# EAGLE design pmm (EAGLE 9.6.1)
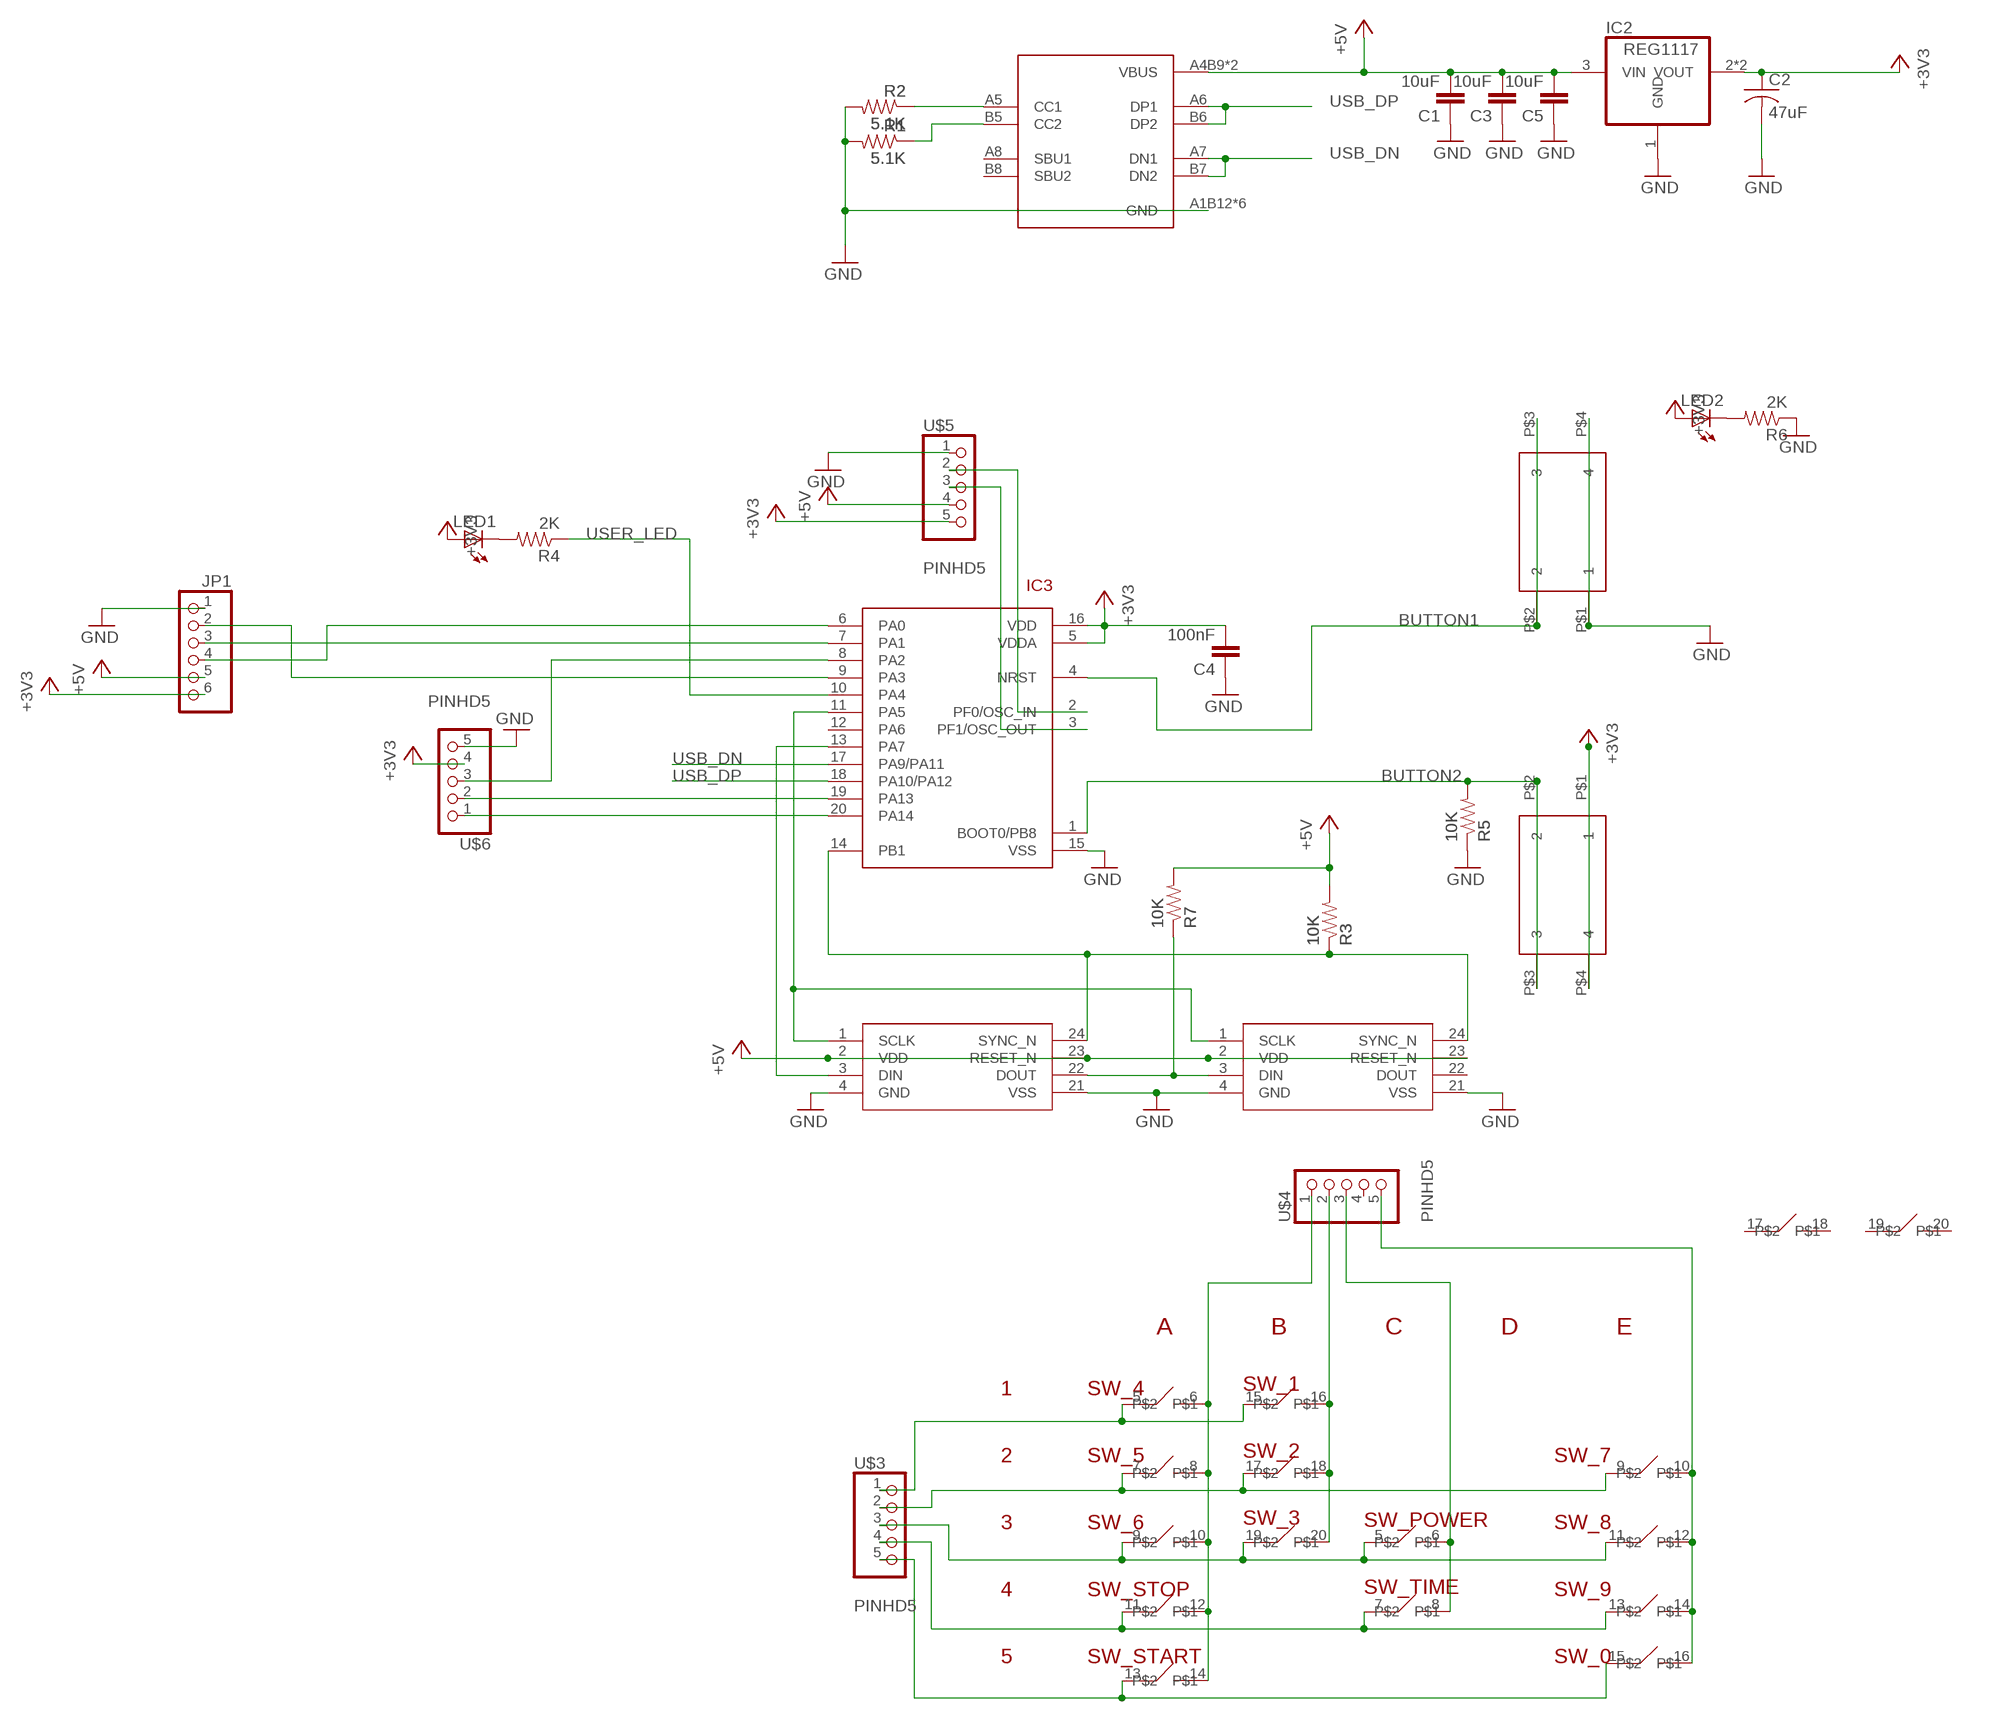
[diagram p0: schematic, sheet 1]

## Parts
C1  10uF  CAP0805  [0805@1]
C2  47uF  C-USC1210  [C1210]
C3  10uF  CAP0805  [0805@1]
C4  100nF  CAP0805  [0805@1]
C5  10uF  CAP0805  [0805@1]
IC2  REG1117  [SOT223]
IC3  STM32F042F4  [TSSOP20]
JP1  PINHD-1X6CB  [1X06-CLEANBIG]
LED1  LEDCHIP-LED0805  [CHIP-LED0805]
LED2  LEDCHIP-LED0805  [CHIP-LED0805]
R1  5.1K  RESISTOR0805-RES  [0805]
R2  5.1K  RESISTOR0805-RES  [0805]
R3  10K  RESISTOR0805-RES  [0805]
R4  2K  RESISTOR0805-RES  [0805]
R5  10K  RESISTOR0805-RES  [0805]
R6  2K  RESISTOR0805-RES  [0805]
R7  10K  RESISTOR0805-RES  [0805]
SW3  324_SW  [342_SWICH_FOOT]
SW4  324_SW  [342_SWICH_FOOT]
U2  USBC_16P  [USBC_16P_FOOT]
U$1  ADG714_SEPERATE  [TSSOP-24]
U$2  ADG714_SEPERATE  [TSSOP-24]
U$3  PINHD5  [1X05]
U$4  PINHD5  [1X05]
U$5  PINHD5  [1X05]
U$6  PINHD5  [1X05]

## Nets
1: U$1.5 U$1.15 U$3.1
2: U$1.7 U$1.17 U$2.9 U$3.2
3: U$1.9 U$1.19 U$2.5 U$2.11 U$3.3
4: U$1.11 U$2.7 U$2.13 U$3.4
5: U$1.13 U$2.15 U$3.5
+3V3: C2.1 C4.2 IC2.2(VOUT) IC2.4(VOUT) IC3.5(VDDA) IC3.16(VDD) JP1.6 LED1.A LED2.A SW4.P$1 SW4.P$4 U$5.5 U$6.4
+5V: C1.2 C3.2 C5.2 IC2.3(VIN) JP1.5 R3.2 R7.2 U2.A4B9(VBUS) U2.B4A9(VBUS) U$1.2(VDD) U$1.23(RESET_N) U$2.2(VDD) U$2.23(RESET_N) U$5.4
A: U$1.6 U$1.8 U$1.10 U$1.12 U$1.14 U$4.1
B: U$1.16 U$1.18 U$1.20 U$4.2
BUTTON1: IC3.4(NRST) SW3.P$2 SW3.P$3
BUTTON2: IC3.1(BOOT0/PB8) R5.2 SW4.P$2 SW4.P$3
C: U$2.6 U$2.8 U$4.3
E: U$2.10 U$2.12 U$2.14 U$2.16 U$4.5
GND: C1.1 C2.2 C3.1 C4.1 C5.1 IC2.1(GND) IC3.15(VSS) JP1.1 R1.2 R2.2 R5.1 R6.1 SW3.P$1 SW3.P$4 U2.A1B12(GND) U2.B11A12(GND) U2.P$13(GND) U2.P$14(GND) U2.P$15(GND) U2.P$16(GND) U$1.4(GND) U$1.21(VSS) U$2.4(GND) U$2.21(VSS) U$5.1 U$6.5
N$1: IC3.11(PA5) U$1.1(SCLK) U$2.1(SCLK)
N$2: IC3.13(PA7) U$1.3(DIN)
N$3: R7.1 U$1.22(DOUT) U$2.3(DIN)
N$4: IC3.14(PB1) R3.1 U$1.24(SYNC_N) U$2.24(SYNC_N)
N$5: LED1.C R4.2
N$6: IC3.8(PA2) U$6.3
N$7: IC3.20(PA14) U$6.1
N$8: IC3.19(PA13) U$6.2
N$9: IC3.9(PA3) JP1.2
N$10: IC3.7(PA1) JP1.3
N$11: IC3.6(PA0) JP1.4
N$12: IC3.2(PF0/OSC_IN) U$5.2
N$13: IC3.3(PF1/OSC_OUT) U$5.3
N$29: LED2.C R6.2
N$31: R1.1 U2.B5(CC2)
N$33: R2.1 U2.A5(CC1)
USB_DN: IC3.17(PA9/PA11) U2.A7(DN1) U2.B7(DN2)
USB_DP: IC3.18(PA10/PA12) U2.A6(DP1) U2.B6(DP2)
USER_LED: IC3.10(PA4) R4.1
Unconnected: IC3.12(PA6) U2.A8(SBU1) U2.B8(SBU2) U$2.17 U$2.18 U$2.19 U$2.20 U$2.22(DOUT) U$4.4

## Notes on the sheet
- A              B              C              D              E
- SW_1
  
  
  SW_2
  
  
  SW_3
- SW_POWER
  
  
  SW_TIME
- 1
  
  
  2
  
  
  3
  
  
  4
  
  
  5
- SW_4
  
  
  SW_5
  
  
  SW_6
  
  
  SW_STOP
  
  
  SW_START
- SW_7
  
  
  SW_8
  
  
  SW_9
  
  
  SW_0

## Library data of the parts
C1 C3-C5 = clock:CAP: Capacitor Standard 0603 ceramic capacitor, and 0.1" leaded capacitor.
C2 = clock:C-US: CAPACITOR, American symbol
IC2 = clock:REG1117: 800mA and 1A Low Dropout (LDO) Positive Regulator 1.8V, 2.5V, 2.85V, 3.3V, 5V, and Adj; MPN: REG1117; OC_FARNELL: 1097566; OC_NEWARK: 14P6981
IC3 = tx:STM32F042F4
JP1 = adafruit:PINHD-1X6: PIN HEADER
LED1 LED2 = adafruit:LED: LED OSRAM: - CHIPLED LG R971, LG N971, LY N971, LG Q971, LY Q971, LO R971, LY R971 LH N974, LH R974 LS Q976, LO Q976, LY Q976 LO Q996 - Hyper CHIPLED LW Q18S LB Q993, LB Q99A, LB R99A - SideLED LS A670, LO A670, LY A670, LG A670, LP A670 LB A673, LV A673, LT A673, LW A673 LH A674 LY A675 LS A676, LA A676, LO A676, LY A676, LW A676 LS A679, LY A679, LG A679 - Hyper Micro SIDELED® LS Y876, LA Y876, LO Y876, LY Y876 LT Y87S - SmartLED LW L88C, LW L88S LB L89C, LB L89S, LG L890 LS L89K, LO L89K, LY L89K LS L896, LA L896, LO L896, LY L896 - TOPLED LS T670, LO T670, LY T670, LG T670, LP T670 LSG T670, LSP T670, LSY T670, LOP T670, LYG T670 LG T671, LOG T671, LSG T671 LB T673, LV T673, LT T673, LW T673 LH T674 LS T676, LA T676, LO T676, LY T676, LB T676, LH T676, LSB T676, LW T676 LB T67C, LV T67C, LT T67C, LS T67K, LO T67K, LY T67K, LW E67C LS E67B, LA E67B, LO E67B, LY E67B, LB E67C, LV E67C, LT E67C LW T67C LS T679, LY T679, LG T679 LS T770, LO T770, LY T770, LG T770, LP T770 LB T773, LV T773, LT T773, LW T773 LH T774 LS E675, LA E675, LY E675, LS T675 LS T776, LA T776, LO T776, LY T776, LB T776 LHGB T686 LT T68C, LB T68C - Hyper Mini TOPLED® LB M676 - Mini TOPLED Santana® LG M470 LS M47K, LO M47K, LY M47K Source: http://www.osram.convergy.de/
R1-R3 R5 R7 = joyAnalog:RESISTOR: Resistor Basic schematic elements and footprints for 0603, 1206, and PTH resistors.
R4 R6 = SparkFun-Passives:RESISTOR: Resistor Basic schematic elements and footprints for 0603, 1206, and PTH resistors.
SW3 SW4 = 3pos_slide_switch_centered:324_SW
U2 = my_usbc_16p:USBC_16P
U$1 U$2 = pmm:ADG714_SEPERATE
U$3-U$6 = adafruit_changed:PINHD5

## Board
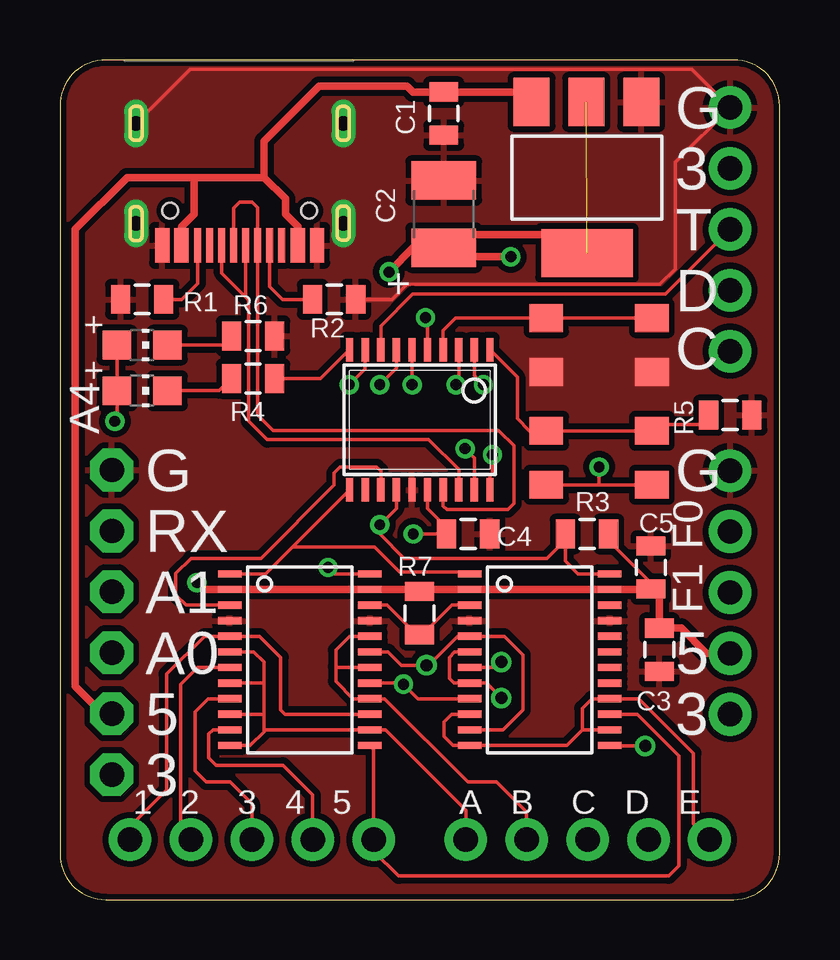
[diagram p1: board, top side]
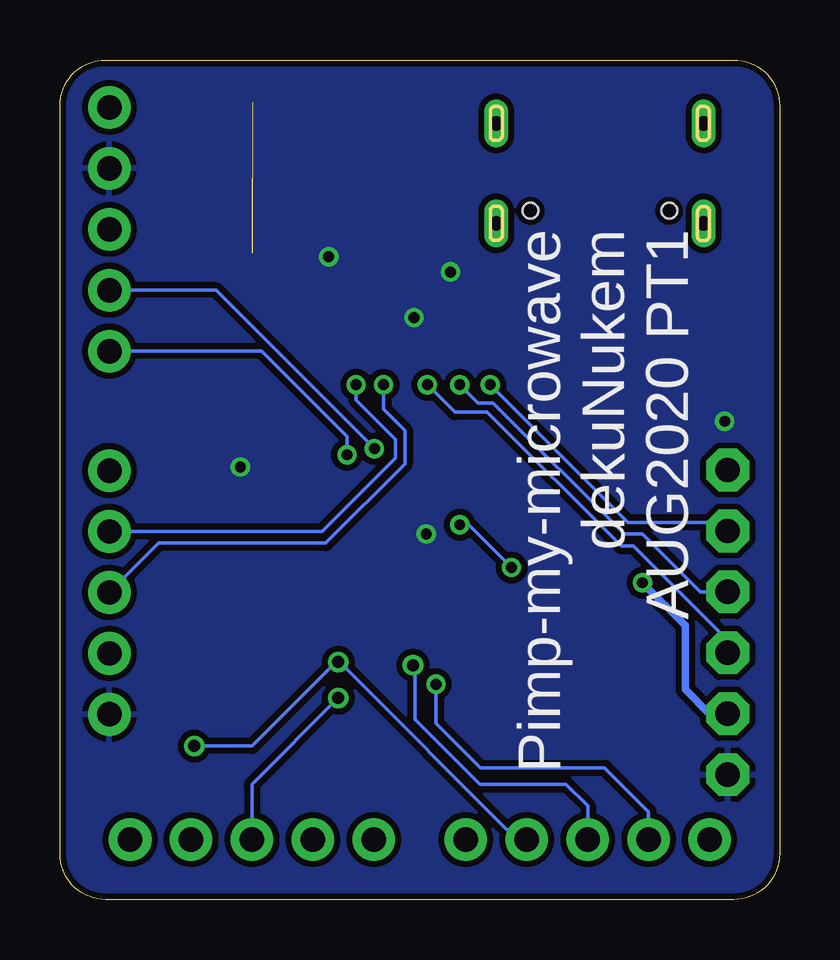
[diagram p2: board, bottom side, seen from below]

Size 30 x 35 mm. Coordinates in mm from the lower left corner, seen from the top.
Outline: 0,33.09 0,1.91 arc90 1.91,0 28.09,0 arc90 30,1.91 30,33.09 arc90 28.09,35 1.91,35 arc90 0,33.09
Copper layers (1*16): Top 0.035mm / dielectric 1.5mm / Bottom 0.035mm
Design rules "deku_2layer_6mil": minimum track width 6mil, minimum drill 15mil, track to track 6mil, track to pad 6mil, pad to pad 6mil, via to via 6mil, smd to smd 6mil, copper to edge 10mil, drill to drill 6mil, minimum pad ring 7mil, minimum via ring 7mil, stop-mask expansion 4mil, vias tented up to drill 25mil, thermal gap 10mil

### Footprints (pad centres in the part's own frame; a part is rotated, then mirrored left to right if it is on the bottom)
0805@1 = smd 0.8 x 1.2: 1 -0.9,0; 2 0.9,0
C1210 = smd 1.6 x 2.7: 1 -1.4,0; 2 1.4,0
SOT223 = smd 1.499 x 2.007: 1 -2.261,-3.15; 2 0.025,-3.15; 3 2.311,-3.15 | smd 3.81 x 2.007: 4 0,3.15
TSSOP20 = smd 0.305 x 0.991: 1 -2.925,-2.918; 2 -2.275,-2.918; 3 -1.625,-2.918; 4 -0.975,-2.918; 5 -0.325,-2.918; 6 0.325,-2.918; 7 0.975,-2.918; 8 1.625,-2.918; 9 2.275,-2.918; 10 2.925,-2.918; 11 2.925,2.918; 12 2.275,2.918; 13 1.625,2.918; 14 0.975,2.918; 15 0.325,2.918; 16 -0.325,2.918; 17 -0.975,2.918; 18 -1.625,2.918; 19 -2.275,2.918; 20 -2.925,2.918
1X06-CLEANBIG = drill 1.016 pad 1.778 octagon: 1 -6.35,0; 2 -3.81,0; 3 -1.27,0; 4 1.27,0; 5 3.81,0; 6 6.35,0
CHIP-LED0805 = smd 1.2 x 1.2: A 0,-1.05; C 0,1.05
0805 = smd 0.8 x 1.2: 1 -0.9,0; 2 0.9,0
342_SWICH_FOOT = smd 1.4 x 1.15: P$1 -2.2,-1.125; P$2 -2.2,1.125; P$3 2.2,1.125; P$4 2.2,-1.125
USBC_16P_FOOT = smd 0.6 x 1.45: A1B12 -3.225,3.848; A4B9 -2.425,3.848; B4A9 2.425,3.848; B11A12 3.225,3.848 | smd 0.3 x 1.45: A5 -1.25,3.848; A6 -0.25,3.848; A7 0.25,3.848; A8 1.25,3.848; B5 1.75,3.848; B6 0.75,3.848; B7 -0.75,3.848; B8 -1.75,3.848 | drill 0.6 pad 1 long: P$13 -4.32,2.933; P$14 4.32,2.933; P$15 -4.32,-1.248; P$16 4.32,-1.248 | hole 0.65: -2.89,2.402; 2.89,2.402
TSSOP-24 = smd 0.305 x 0.991: 1 -3.575,-2.918; 2 -2.925,-2.918; 3 -2.275,-2.918; 4 -1.625,-2.918; 5 -0.975,-2.918; 6 -0.325,-2.918; 7 0.325,-2.918; 8 0.975,-2.918; 9 1.625,-2.918; 10 2.275,-2.918; 11 2.925,-2.918; 12 3.575,-2.918; 13 3.575,2.918; 14 2.925,2.918; 15 2.275,2.918; 16 1.625,2.918; 17 0.975,2.918; 18 0.325,2.918; 19 -0.325,2.918; 20 -0.975,2.918; 21 -1.625,2.918; 22 -2.275,2.918; 23 -2.925,2.918; 24 -3.575,2.918
1X05 = drill 1.016 pad 1.778: 1 -6.35,0; 2 -3.81,0; 3 -1.27,0; 4 1.27,0; 5 3.81,0

### Placement (x,y rotation side)
C1  16,32.77 90 top
C2  16,28.57 90 top
C3  24.99,10.41 90 top
C4  17.02,15.24 180 top
C5  24.64,13.84 270 top
IC2  21.97,30.1 180 top
IC3  15,20 180 top
JP1  2.16,11.56 270 top
LED1  3.43,21.21 270 top
LED2  3.43,23.11 270 top
R1  3.43,25.02 180 top
R2  11.43,25.02 0 top
R3  21.97,15.24 0 top
R4  8.05,21.72 180 top
R5  27.94,20.19 180 top
R6  8.05,23.5 180 top
R7  14.99,11.94 90 top
SW3  22.48,23.11 0 top
SW4  22.48,18.41 0 top
U2  7.49,31.11 180 top
U$1  10,10 270 top
U$2  20,10 270 top
U$3  9.27,2.5 0 top
U$4  23.27,2.5 0 top
U$5  27.94,11.53 270 top
U$6  27.94,29.21 90 top

### Tracks (layer width: path | path; a pad name or v marks a point on that pad's centre or on a via)
1
  Top 0.152: U$1.15 9.38,7.72 9.2,7.9 9.2,10.1 8.32,10.97 U$1.5 6.02,10.97 4.45,9.4 4.45,4.57 2.92,3.05 U$3.1
2  (via drill 0.45)
  Top 0.152: U$1.17 14.28,9.03 v14.32,8.97 14.93,8.38 U$2.9 | U$1.7 5.74,9.68 5.03,8.97 5.03,2.93 U$3.2
  Bottom 0.152: v14.32,8.97 14.32,7.35 12.48,5.5 7.3,5.5 5.46,3.66 U$3.2
3  (via drill 0.5)
  Top 0.152: U$1.9 6.17,8.38 5.63,7.83 5.63,5.37 6.1,4.9 7.1,4.9 8,4 U$3.3 | U$2.11 18.48,7.08 19.3,7.9 19.3,10.2 18.52,10.97 U$2.5 16.56,10.97 15.36,9.77 v15.28,9.77 14.23,9.77 13.68,10.32 U$1.19
  Bottom 0.152: v15.28,9.77 15.2,9.69 15.2,7.5 12.49,4.8 8.9,4.8 8,3.9 U$3.3
4  (via drill 0.5)
  Top 0.152: U$1.11 6.38,7.08 6.2,6.9 6.2,5.9 6.5,5.6 9.3,5.6 10.54,4.36 U$3.4 | U$2.7 18.18,9.68 v18.4,9.9 | v24.4,6.4 22.94,6.4 U$2.13
  Bottom 0.152: v24.4,6.4 21.99,6.4 18.49,9.9 v18.4,9.9 18.34,9.9 10.94,2.5 U$3.4
5
  Top 0.152: U$2.15 24.07,7.72 25.8,6 25.8,1.4 25.38,0.98 14.12,0.98 13.08,2.02 U$3.5 13.08,6.26 U$1.13
+3V3  (via drill 0.45)  (1 unrouted)
  Top 0.152: v14.73,15.24 C4.2 16.12,15.51 15.32,16.3 IC3.16 | SW4.P$1 22.48,17.29 | 22.48,17.29 SW4.P$4 | v22.48,18.03 22.48,17.29 | LED2.A LED1.A 2.38,20.03 v2.29,19.94 | v15.24,24.26 15.32,24.17 IC3.5
  Top 0.305: C2.1 16.54,27.71 21.21,27.71 IC2.4 | C2.1 14.73,27.18 v13.72,26.16 | C2.1 16.38,26.8 v18.8,26.8
  pour Bottom (isolate 0.254): 0,35 30,35 30,0 0,0
+5V  (via drill 0.45)
  Top 0.152: R3.2 22.87,14.97 24.64,13.21 C5.2
  Top 0.305: IC2.3 19.24,33.67 C1.2 14.72,33.67 14.48,33.91 10.79,33.91 8.51,31.62 8.51,30.1 | JP1.5 1.78,7.75 0.64,8.89 0.64,27.94 2.79,30.1 5.59,30.1 | v5.71,13.21 6,12.93 U$1.2 U$1.23 14.9,12.93 R7.2 15.07,12.93 U$2.2 U$2.23 24.62,12.93 C5.2 24.99,12.59 C3.2 25.9,11.31 26.95,10.26 U$5.4 | 5.59,30.1 8.51,30.1 | 8.51,30.1 9.4,29.21 9.4,28.57 9.92,28.05 U2.A4B9 | U2.B4A9 5.07,28.05 5.59,28.57 5.59,30.1
  Bottom 0.305: v5.71,13.21 3.94,11.43 3.94,8.76 2.92,7.75 JP1.5
A
  Top 0.152: U$1.6 8.07,10.32 8.5,9.9 8.5,9 | 8.5,9 8.5,7.7 | 8.5,7.7 8.5,7.1 | 8.5,7.1 8.5,7 7.92,6.42 U$1.12 | U$1.8 8.47,9.03 8.5,9 | U$1.10 8.47,7.72 8.5,7.7 | 8.5,7.1 8.53,7.08 U$1.14 13.57,7.08 16.92,3.73 U$4.1
B
  Top 0.152: U$1.20 12.07,10.97 11.5,10.4 11.5,9.7 | 11.5,9.7 11.5,9.1 12.22,8.38 U$1.16 13.53,8.38 17,4.9 18.2,4.9 19.46,3.64 U$4.2 | U$1.18 11.53,9.68 11.5,9.7
BUTTON1
  Top 0.152: IC3.4 15.97,23.72 16.49,24.24 SW3.P$2 SW3.P$3
BUTTON2
  Top 0.152: IC3.1 19.07,21.77 19.07,20.05 19.58,19.54 SW4.P$2 SW4.P$3 24.95,19.81 26.66,19.81 R5.2
C  (via drill 0.5)
  Top 0.152: U$2.6 16.45,10.32 16.23,10.1 16.23,9.22 16.43,9.03 U$2.8 17.77,9.03 v18.4,8.4
  Bottom 0.152: v18.4,8.4 22,4.8 U$4.3
E
  Top 0.152: 21.77,7.08 U$2.14 | 21.77,7.08 21.12,6.42 U$2.12 16.38,6.42 16,6.8 16,7.4 16.32,7.72 U$2.10 | 21.77,7.08 21.77,7.97 22.18,8.38 U$2.16 24.14,8.38 26.42,6.1 26.42,3.16 U$4.5
GND
  Top 0.152: R2.2 13.84,25.02 14.48,25.65 25.02,25.65 25.65,26.29 25.65,30.73 U$6.5 26.34,34.62 5.42,34.62 3.17,32.37 U2.P$16
  pour Top (isolate 0.254): 0,35 0,0 30,0 30,35
N$1
  Top 0.152: IC3.11 9.69,14.7 | 9.69,14.7 8.57,13.57 U$1.1 | U$2.1 17.01,13.65 14.16,13.65 13.12,14.7 9.69,14.7
N$2
  Top 0.152: IC3.13 13.38,17.87 13.21,18.03 11.68,18.03 11.43,17.78 11.43,17.27 8.38,14.22 5.46,14.22 4.83,13.59 4.83,12.7 5.25,12.28 U$1.3
N$3
  Top 0.152: U$1.22 13.63,12.28 14.99,10.92 | 14.99,10.92 R7.1 | U$2.3 16.34,12.28 14.99,10.92
N$4  (via drill 0.45)
  Top 0.152: U$2.24 21.6,13.57 21.07,14.11 R3.1 21.01,15.18 21.01,14.93 20.31,14.22 14.35,14.22 13.34,15.24 v13.34,15.62 14.03,16.31 IC3.14 | U$1.24 11.44,13.57 v11.18,13.84
  Bottom 0.152: v11.18,13.84 12.95,15.62 v13.34,15.62
N$5
  Top 0.152: R4.2 6.64,21.21 LED1.C
N$6
  Top 0.152: IC3.8 13.38,23.92 14.71,25.25 25.25,25.25 U$6.3
N$7  (via drill 0.45)
  Top 0.152: v18.03,18.54 18.03,17.78 17.93,17.67 IC3.20
  Bottom 0.152: v18.03,18.54 18.03,19.3 21.59,22.86 U$6.1
N$8  (via drill 0.45)
  Top 0.152: IC3.19 17.27,18.41 v16.89,18.8
  Bottom 0.152: v16.89,18.8 23.5,25.4 U$6.2
N$9  (via drill 0.45)
  Top 0.152: IC3.9 12.72,22.12 v12.06,21.46
  Bottom 0.152: v12.06,21.46 6.32,15.72 2.51,15.72 JP1.2
N$10  (via drill 0.45)
  Top 0.152: IC3.7 14.03,22.15 v13.34,21.46
  Bottom 0.152: v13.34,21.46 12.57,20.7 11.94,20.7 6.48,15.24 5.71,15.24 3.3,12.83 JP1.3
N$11  (via drill 0.45)
  Top 0.152: IC3.6 v14.68,21.46
  Bottom 0.152: JP1.4 2.16,10.79 6.1,14.73 6.6,14.73 12.19,20.32 13.54,20.32 v14.68,21.46
N$12  (via drill 0.45)
  Top 0.152: IC3.2 17.27,21.84 v17.65,21.46
  Bottom 0.152: v17.65,21.46 17.65,20.83 16,19.18 16,18.41 19.07,15.34 U$5.2
N$13  (via drill 0.45)
  Top 0.152: IC3.3 16.62,21.58 v16.51,21.46
  Bottom 0.152: v16.51,21.46 16.51,20.45 15.62,19.56 15.62,18.16 18.92,14.86 25.88,14.86 U$5.3
N$29
  Top 0.152: R6.2 6.77,23.11 LED2.C
N$31
  Top 0.152: U2.B5 5.74,25.68 5.08,25.02 R1.1
N$33
  Top 0.152: U2.A5 8.74,25.55 9.27,25.02 R2.1
USB_DN
  Top 0.152: IC3.17 15.97,16.41 16.13,16.26 18.67,16.26 18.92,16.51 18.92,18.92 18.29,19.56 8.89,19.56 8.24,20.2 U2.B7 8.24,28.84 8,29.08 7.49,29.08 7.24,28.83 U2.A7
USB_DP
  Top 0.152: IC3.18 16.62,17.92 15.37,19.18 8.64,19.18 7.87,19.94 7.87,24.99 7.74,25.12 | U2.A6 7.74,25.12 | 7.74,25.12 6.74,26.12 U2.B6
USER_LED
  Top 0.152: IC3.10 10.87,21.72 R4.1

### Text on the board
tPlace: G | 3 | T | D | A4 | C | G | G | F0 | RX | A1 | F1 | A0 | 5 | 5 | 3 | 1 2 3 4 5 | 3 | A B C D E
bPlace: Pimp-my-microwave / dekuNukem / AUG2020 PT1